# Altium project ActiTouch.PrjPcb
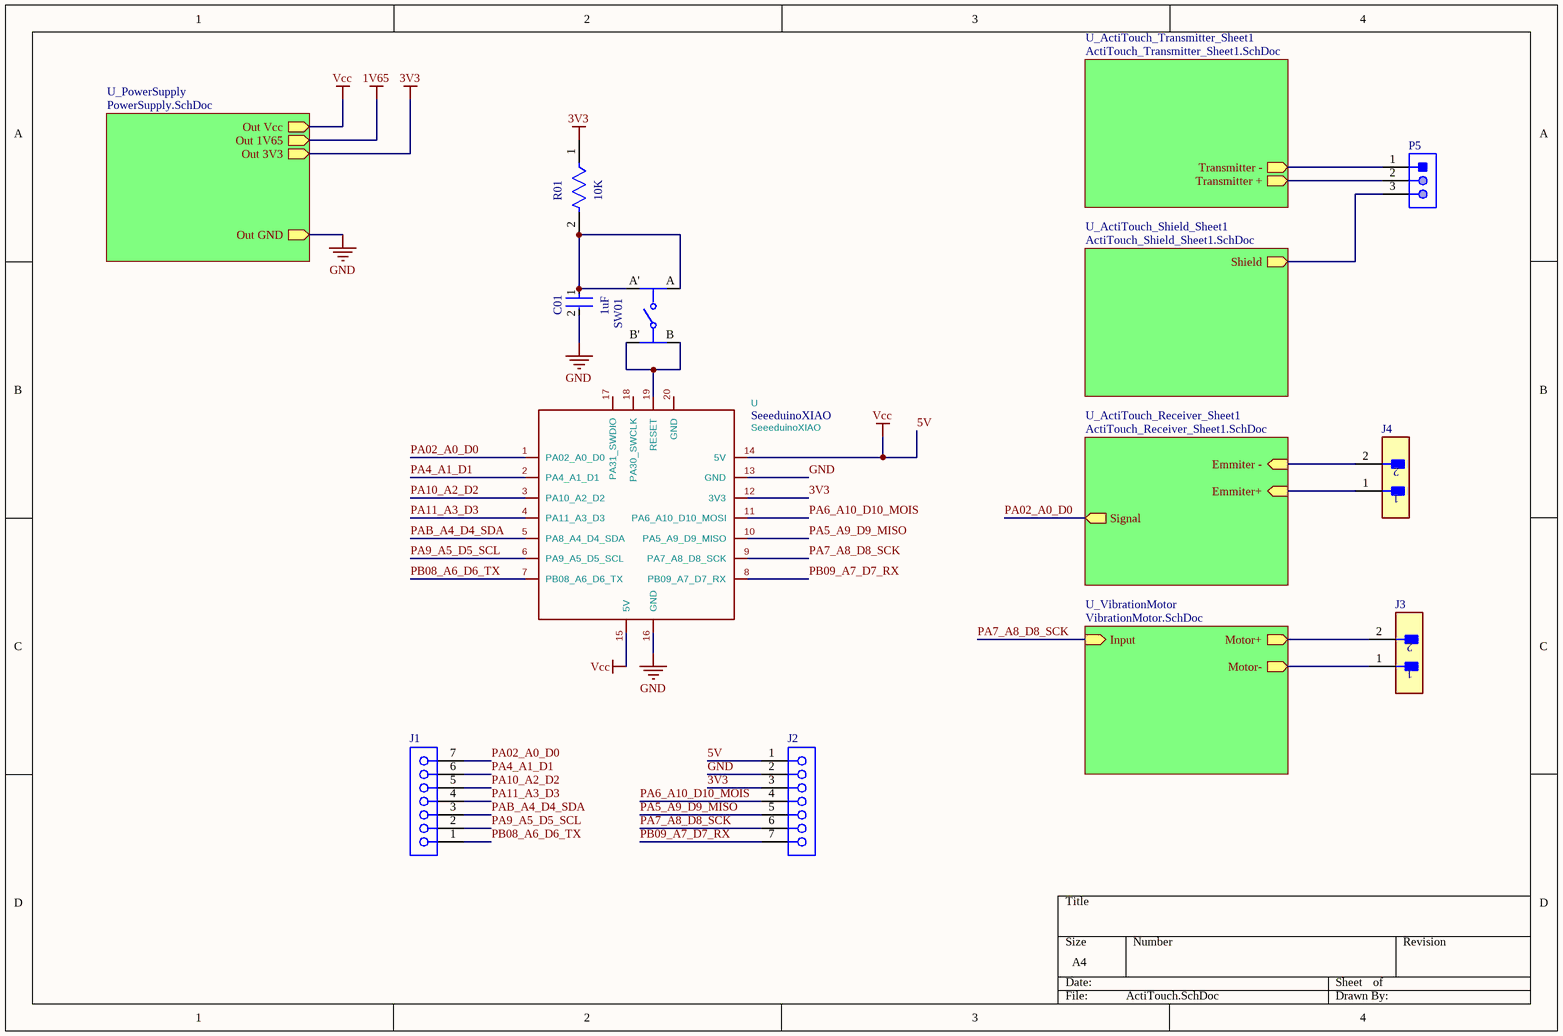
[diagram p0: ActiTouch.SchDoc]
6 sheets, 65 parts. Net scope: hierarchical (ports join the sheet entries above them; power ports are global).
Board files: ActiTouch_PCB1.PcbDoc, ActiTouch_PCB2.PcbDoc
Sheets:
  ActiTouch.SchDoc
    U_ActiTouch_Shield_Sheet1 = ActiTouch_Shield_Sheet1.SchDoc
    U_VibrationMotor = VibrationMotor.SchDoc
    U_ActiTouch_Receiver_Sheet1 = ActiTouch_Receiver_Sheet1.SchDoc
    U_ActiTouch_Transmitter_Sheet1 = ActiTouch_Transmitter_Sheet1.SchDoc
    U_PowerSupply = PowerSupply.SchDoc

## Sheet ActiTouch.SchDoc
size A4; SheetNumber: 1; SheetTotal: 6

### Parts
C01  1uF  [FP-0603-L_1_6_0_15-W_0_81-IPC_A]
J1  SSQ-107-01-G-S  [SMTC-SSQ-107-01-X-S]  (value not drawn)
J2  SSQ-107-01-G-S  [SMTC-SSQ-107-01-X-S]  (value not drawn)
J3  GRPB021VWVN-RC  [FP-GRPB021VWVN-RC-MFG]  (value not drawn)
J4  GRPB021VWVN-RC  [FP-GRPB021VWVN-RC-MFG]  (value not drawn)
P5  GRPB031VWVN-RC  [SLIN-GRPB031VWVN-RC_V]  (value not drawn)
R01  10K  [FP-RNCP0603-MFG]
SW01  EVPAF7B70  [FP-EVPAF7B70-MFG]  (value not drawn)
U  SeeeduinoXIAO  [Seeeduino XIAO-MOUDLE14P-2.54-21X17.8MM]

### Sub-sheets
U_ActiTouch_Receiver_Sheet1 = ActiTouch_Receiver_Sheet1.SchDoc: Emmiter+ (in), Emmiter - (in), Signal (out)
U_ActiTouch_Shield_Sheet1 = ActiTouch_Shield_Sheet1.SchDoc: Shield (out)
U_ActiTouch_Transmitter_Sheet1 = ActiTouch_Transmitter_Sheet1.SchDoc: Transmitter + (out), Transmitter - (out)
U_PowerSupply = PowerSupply.SchDoc: Out Vcc (out), Out 1V65 (out), Out GND (out), Out 3V3 (out)
U_VibrationMotor = VibrationMotor.SchDoc: Input (in), Motor+ (out), Motor- (out)

### Nets
3V3: J2.3 R01.1 U.12(3V3) ; sheet U_PowerSupply/Out 3V3
5V: J2.1 U.14(5V) U.15(5V) ; sheet U_PowerSupply/Out Vcc  [also labelled Vcc]
GND: C01.2 J2.2 U.13(GND) U.16(GND) ; sheet U_PowerSupply/Out GND
PA02_A0_D0: J1.7 U.1(PA02_A0_D0) ; sheet U_ActiTouch_Receiver_Sheet1/Signal
PA4_A1_D1: J1.6 U.2(PA4_A1_D1)
PA5_A9_D9_MISO: J2.5 U.10(PA5_A9_D9_MISO)
PA6_A10_D10_MOIS: J2.4 U.11(PA6_A10_D10_MOSI)
PA7_A8_D8_SCK: J2.6 U.9(PA7_A8_D8_SCK) ; sheet U_VibrationMotor/Input
PA9_A5_D5_SCL: J1.2 U.6(PA9_A5_D5_SCL)
PA10_A2_D2: J1.5 U.3(PA10_A2_D2)
PA11_A3_D3: J1.4 U.4(PA11_A3_D3)
PAB_A4_D4_SDA: J1.3 U.5(PA8_A4_D4_SDA)
PB08_A6_D6_TX: J1.1 U.7(PB08_A6_D6_TX)
PB09_A7_D7_RX: J2.7 U.8(PB09_A7_D7_RX)
NetC01_1: C01.1 R01.2 SW01.A SW01.A'
NetC1_2: P5.2 ; sheet U_ActiTouch_Transmitter_Sheet1/Transmitter +
NetC3_2: P5.1 ; sheet U_ActiTouch_Transmitter_Sheet1/Transmitter -
NetC20_1: J4.1 ; sheet U_ActiTouch_Receiver_Sheet1/Emmiter+
NetC21_1: J4.2 ; sheet U_ActiTouch_Receiver_Sheet1/Emmiter -
NetC41_1: J3.1 ; sheet U_VibrationMotor/Motor-
NetC41_2: J3.2 ; sheet U_VibrationMotor/Motor+
NetC51_1: P5.3 ; sheet U_ActiTouch_Shield_Sheet1/Shield
NetSW01_B: SW01.B SW01.B' U.19(RESET)

Not connected (* = marked no-connect by the designer): U 17(PA31_SWDIO) 18(PA30_SWCLK) 20(GND)

### Library data of the parts
C01 = CMP-2006-04559-3: General Purpose Ceramic Capacitor, 0603, 1uF, 10%, X5R, 15%, 10V; Insulation Resistance: 100GR; Dissipation Factor: 5%; Packaging: Tape and Reel; RoHS Compliant: Yes; Height: 0.9mm; Tolerance: 10%; Length: 1.6mm; Depth: 0.81mm; Case/Package: 0603; Max Operating Temperature: 85°C; Series: -; Dielectric: X5R; Construction: Flat; Capacitance: 1uF; REACH SVHC: No SVHC; Voltage Rating: 10V; Number of Pins: 2; Radiation Hardening: No; Case Code (Imperial): 0603; Min Operating Temperature: -55°C; Termination: SMD/SMT; Contact Plating: Tin; Voltage: 10V; Thickness: 0.035inch; Lead Free: Lead Free; Mount: Surface Mount; Width: 0.81mm; Voltage Rating (DC): 10V; Package Quantity: 4000; Case Code (Metric): 1608
J1 J2 = CMP-1023-00284-1: SQ Post Socket, Through-hole, Vertical, -55 to 125 degC, 2.54 mm Pitch, 7-Pin, Female, RoHS; Manufacturer: Samtec; Pitch: 2.54 mm; PackageDescription: Assembly, Socket Strip .025[0.64] SQ Tail; PartNumber: SSQ-107-01-G-S; PackageReference: SSQ-107-01-X-S; ComponentLink2URL: http://www.samtec.com/documents/webfiles/pdf/SSQ_TH.PDF; ComponentLink1URL: http://www.samtec.com; ComponentLink3Description: Package Specification; PackageVersion: BD, 6/1987; RoHS: True; DatasheetVersion: F-214; Mounting Technology: Through-hole; ComponentLink3URL: http://www.samtec.com/documents/webfiles/cpdf/SSQ-1XX-XX-XXX-X-XX-XXX-XX-X-MKT.pdf; ComponentLink1Description: Manufacturer URL; Temperature Range: -55 to 125 degC; Orientation: Vertical; ComponentLink2Description: Datasheet
J3 J4 = CMP-2000-06371-2: CONN HEADER VERT 2POS 1.27MM; Number of Positions: 2; Connector Type: Male Pin; Pitch: 0.05inch; Contact Plating: Gold; Lead Free: Lead Free; Termination: Solder; Packaging: Bulk; RoHS Compliant: Yes; Contact Type: Male Pin; Mount: Through Hole; Number of Rows: 1; Contact Mating Length: 0.118inch; Package Quantity: 1
P5 = CMP-2000-06372-1: Male Header, Pitch 1.27 mm, 1 x 3 Position, Height 4 mm, Tail Length 2.3 mm, -40 to 105 degC, RoHS, Bulk; Manufacturer: Sullins; Other Names: S9014E-03; Number of Positions: 3; Connector Type: Header,Unshrouded; Pitch: 0.050"(1.27mm); Dynamic Catalog: GRPB; Catalog Drawings: S9014ESeriesTop; Mating Products: S9010E-03-ND / -CONNHEADER.050"3POSR/APCB / S9008E-03-ND / -CONNHEADER.050"3POSPCBGOLD / S9005E-03-ND / -CONNHEADER.050"3POSSMDGOLD; Number of Positions Loaded: All; Contact Finish: Gold; Mounting Type: ThroughHole; Termination: Solder; Packaging: Bulk; Category: Connectors,Interconnects; Package Description: Male Header, Pitch 1.27 mm, 1 x 3 Position, Height 4 mm, Tail Length 2.3 mm; Standard Package: 1; Datasheet URL: http://www.sullinscorp.com/drawings/71_GRPB___1VWVN-RC,_10957-C.pdf; Package Reference: GRPB031VWVN-RC; Family: RectangularConnectors-Headers,MalePins; Number of Rows: 1; Contact Type: MalePin; Manufacturer URL: http://www.sullinscorp.com/; Mounting Technology: ThroughHole; Contact Mating Length: 0.118"(3.00mm); Contact Finish Thickness: Flash; Datasheet Version: Rev. C, 12/2008
R01 = CMP-26527-000144-1: 12.4kΩ ±1% 0.125W 0603 High Power Anti-Sulfur Thin Film Chip Resistor; Temperature Coefficient: 100ppm/°C; Max Power Dissipation: 125mW; Resistance: 12.4kR; Mount: Surface Mount; Number of Terminations: 2; Case Code (Imperial): 0603; Length: 0.059inch; Tolerance: 1%; Width: 0.031inch; Max Operating Temperature: 155°C; Case/Package: 0603; Packaging: Cut Tape; Min Operating Temperature: -55°C; RoHS Compliant: Yes; Height: 0.02inch; Features: Moisture Resistant; Resistor Type: Thin Film; Case Code (Metric): 1608; Series: RNCP
SW01 = CMP-05618-000093-1: SWITCH TACTILE SPST-NO 0.02A 15V; Mechanical Life: 500000Cycles; Illumination Type: Non-Illuminated; Max Current Rating: 20mA; Switch Travel: 0.15mm; Switch Function: Off-Mom; Operating Force: 2.4N; Contact Resistance: 500mR; Actuator Type: Standard; Current Rating: 50mA; Actuator Length: 0.22mm; Throw Configuration: SPST; REACH SVHC: No SVHC; Max Voltage Rating (DC): 15V; Package Quantity: 1; Radiation Hardening: No; Mount: Surface Mount; Size: 2.6mm; Min Operating Temperature: -40°C; Depth: 3.4mm; Series: EVPAF; Color: Black; Electrical Life: 500000Cycles; Orientation: Straight; Packaging: Tape and Reel; Voltage Rating (DC): 15V; Contact Plating: Silver; Case/Package: SMD/SMT; Termination: J-Bend; Height: 0.7mm; Length: 2.6mm; Max Operating Temperature: 85°C
U = SeeeduinoXIAO: Value: SeeeduinoXIAO

## Sheet ActiTouch_Shield_Sheet1.SchDoc
size A4; SheetNumber: 4; SheetTotal: 6
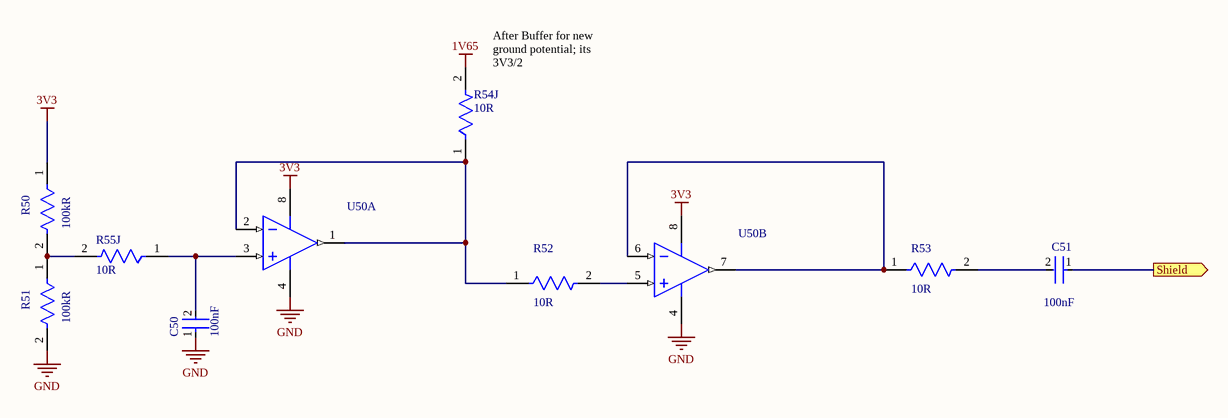
[diagram p1: ActiTouch_Shield_Sheet1.SchDoc]

### Parts
C50  Capacitance: 100nF  [FP-0603-L_1_6_0_1-W_0_8_0-IPC_B]  (hidden comment: EMK107B7104KAHT)
C51  Capacitance: 100nF  [FP-0603-L_1_6_0_1-W_0_8_0-IPC_B]  (hidden comment: EMK107B7104KAHT)
R50  Resistance: 100kR  [FP-RMCF0603-IPC_C]  (hidden comment: RMCF0603FT100K)
R51  Resistance: 100kR  [FP-RMCF0603-IPC_C]  (hidden comment: RMCF0603FT100K)
R52  Resistance: 10R  [FP-RNCP0603-MFG]  (hidden comment: RNCP0603FTD10R0)
R53  Resistance: 10R  [FP-RNCP0603-MFG]  (hidden comment: RNCP0603FTD10R0)
R54J  Resistance: 10R  [FP-RNCP0603-MFG]  (hidden comment: RNCP0603FTD10R0)
R55J  Resistance: 10R  [FP-RNCP0603-MFG]  (hidden comment: RNCP0603FTD10R0)
U50  OPA2836IDR  [D0008A_M]  (value not drawn)  (parts A,B of 2)

### Ports
Shield (out)

### Nets
1V65: R54J.2
3V3: R50.1 U50.8(VS+)
GND: C50.1 R51.2 U50.4(VS-)
NetC50_2: C50.2 R55J.1 U50.3(VIN1+)
NetC51_1: C51.1 ; port Shield
NetC51_2: C51.2 R53.2
NetR50_2: R50.2 R51.1 R55J.2
NetR52_1: R52.1 R54J.1 U50.1(VOUT1) U50.2(VIN1-)
NetR52_2: R52.2 U50.5(VIN2+)
NetR53_1: R53.1 U50.6(VIN2-) U50.7(VOUT2)

### Notes on the sheet
- (near R54J) After Buffer for new ground potential; its 3V3/2

### Library data of the parts
C50 C51 = CMP-14477-003798-2: None; Voltage Rating (DC): 16V; Tolerance: 10%; Package Quantity: 4000; Packaging: Tape and Reel; Lead Free: Lead Free; Voltage Rating: 16V; Halogen Free: Halogen Free; Case/Package: 0603
R50 R51 = CMP-2000-06989-2: 100kΩ ±1% 0.1W 0603 Thick Film Chip Resistor AEC-Q200 compliant; Working Voltage: 75V; Max Power Dissipation: 100mW; Temperature Coefficient: 100ppm/°C; Height: 0.022inch; Construction: Rectangular; Lead Free: Lead Free; Tolerance: 1%; Features: Automotive AEC-Q200; Packaging: Tape and Reel; Number of Terminations: 2; Mount: Surface Mount; Case Code (Imperial): 0603; Case/Package: 0603; Resistor Type: Thick Film; Radiation Hardening: No; Power Rating: 100mW; Max Operating Temperature: 155°C; Length: 1.55mm; Width: 0.031inch; Military Standard: Not; RoHS Compliant: Yes; Min Operating Temperature: -55°C; Series: RMCF; Depth: 0.8mm; Case Code (Metric): 1608; Contact Plating: Tin
R52 R53 R54J R55J = CMP-26527-000751-1: 10Ω ±1% 0.125W 0603 High Power Anti-Sulfur Thin Film Chip Resistor; Temperature Coefficient: 100ppm/°C; Max Power Dissipation: 125mW; Case Code (Imperial): 0603; Case/Package: 0603; Tolerance: 1%; Features: Moisture Resistant; Width: 0.031inch; Series: RNCP; Lead Free: Lead Free; Max Operating Temperature: 155°C; Height: 0.02inch; Length: 0.059inch; Case Code (Metric): 1608; Min Operating Temperature: -55°C; Packaging: Tape and Reel; Resistor Type: Thin Film; RoHS Compliant: Yes; Mount: Surface Mount; Number of Terminations: 2
U50 = CMP-0018-00293-2: Dual, Very Low Power, Rail to Rail Out, Negative Rail In, VFB Operational Amplifier, 2.5 to 5.5 V, -40 to 85 degC, 8-pin SOIC (D8), Green (RoHS & no Sb/Br); Manufacturer: Texas Instruments; Settling Time (0.1%)(Typ)(ns): 30; Iib(Max)(nA): 1000; Vio(Max)(mV): 0.4; Vs(Min)(V): 2.5; Vs(Max)(V): 5.5; Io(Typ)(mA): 50; Sub Family: High Output Current Amplifier (>=50mA), High Speed Amplifier (>=50MHz), Low Noise Amp (<=10nV/rtHz), Low Offset Voltage Amplifier (<=500uV), Low Supply Voltage Amplifier (<=2.7V); Vn at Flatband(Typ)(nV/rtHz): 4.6; Slew Rate(Typ)(V/us): 560; Number of Channels: 2; Iq per channel(Max)(mA): 1; BW @ Acl(MHz): 205; 3rd Harmonic(dBc): 105; 2nd Harmonic(dBc): 85; Mounting Technology: Surface Mount; ComponentLink3URL: http://www.ti.com/litv/pdf/msoi002j; ComponentLink1URL: http://www.ti.com/; DatasheetVersion: SLOS712D; Code_JEDEC: MS-012; PackageDescription: 8-Pin Plastic Small Outline, Body 4.9 x 3.9 mm, Pitch 1.27 mm; ComponentLink3Description: Package Specification; Eco-Plan: Green (RoHS & no Sb/Br); PackageReference: D0008A; PackageVersion: 4040047-3/M, 06/2011; PartNumber: OPA2836IDR; ComponentLink2Description: Datasheet; Acl, min stable gain(V/V): 1; ComponentLink1Description: Manufacturer URL; ComponentLink2URL: http://www.ti.com/general/docs/lit/getliterature.tsp?genericPartNumber=OPA2836&fileType=pdf

## Sheet VibrationMotor.SchDoc
size A4; SheetNumber: 6; SheetTotal: 6
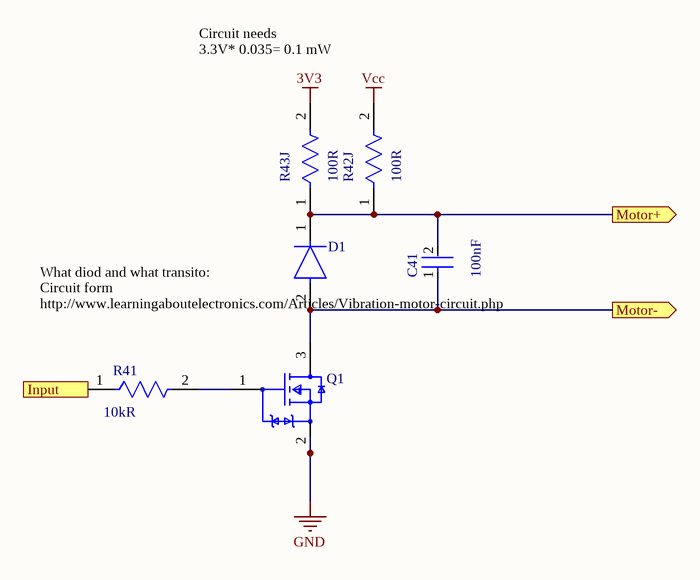
[diagram p2: VibrationMotor.SchDoc]

### Parts
C41  Capacitance: 100nF  [FP-0603-L_1_6_0_1-W_0_8_0-IPC_B]  (hidden comment: EMK107B7104KAHT)
D1  LS4448GS08  [FP-6_560-5006_01-4-MFG]  (value not drawn)
Q1  DMG2302UK-7  [FP-SOT23-MFG]  (value not drawn)
R41  Resistance: 10kR  [FP-RNCP0603-IPC_A]  (hidden comment: RNCP0603FTD10K0)
R42J  Resistance: 100R  [FP-ESR03-MFG]  (hidden comment: ESR03EZPJ101)
R43J  Resistance: 100R  [FP-ESR03-MFG]  (hidden comment: ESR03EZPJ101)

### Ports
Input (in), Motor+ (out), Motor- (out)

### Nets
3V3: R43J.2
GND: Q1.2(S)
Vcc: R42J.2  [project net 5V]
PA7_A8_D8_SCK: R41.1 ; port Input
NetC41_1: C41.1 D1.2(A) Q1.3(D) ; port Motor-
NetC41_2: C41.2 D1.1(C) R42J.1 R43J.1 ; port Motor+
NetQ1_1: Q1.1(G) R41.2

### Notes on the sheet
- Circuit needs
  3.3V* 0.035= 0.1 mW
  With Vibro Motor
  https://www.distrelec.ch/de/vibrationsmotor-seeed-studio-316040004/p/30214484
- What diod and what transito:
  Circuit form http://www.learningaboutelectronics.com/Articles/Vibration-motor-circuit.php

### Library data of the parts
C41 = CMP-14477-003798-2: as C50 on sheet ActiTouch_Shield_Sheet1; Package Quantity: 4000; Packaging: Tape and Reel; Lead Free: Lead Free; Voltage Rating: 16V; Halogen Free: Halogen Free; Case/Package: 0603
D1 = CMP-02540-000047-1: DIODE GEN PURP 100V 300MA SOD80; Manufacturer: Vishay; Max Junction Temp: +175°C; Reverse Voltage: 75V; Peak Reverse Current: 5uA; Automotive Grade: Grade 0; Value: 4pF; Max Surge Forward Current: 2A; Category: Diode; Forward Current: 300mA; ComponentLink2Description: Datasheet; Lead Free: Yes; Automotive: Yes; Device Class L1: Discrete Semiconductors; Temperature: to +175°C; Package: 6.560-5006.01-4; Max Repetitive Reverse Voltage: 100V; RoHS: TRUE; Manufacturer Part Number: LS4448GS08; ComponentLink2URL: http://www.vishay.com/docs/85561/ls4148.pdf; Device Class L3: Rectifier Diodes; Capacitance: 4pF; Octopart: https://octopart.com/ls4448gs08-vishay-55433966; Digikey Description: DIODE GEN PURP 100V 300MA SOD80; Device Class L2: Diodes; Height: 1.6mm; Mouser Description: Diodes - General Purpose, Power, Switching 100V Io/150mA 2.0 Amp IFSM; Temperature Range High: +175°C
Q1 = CMP-12801-000001-1: MOSFET N-CH 20V 2.8A SOT23; Manufacturer: Diodes Inc.; Reverse Recovery Time: 5.3ns; Gate Charge At Vgs: 2.8nC @ 10V; Turn On Delay Time: 0.6ns; Pulse Drain Current: 12A; Max Forward Diode Voltage: 1.2V; Reverse Recovery Charge: 0.5nC; Automotive Grade: Grade 0; Threshold Vgs Min: 0.3V; Number Of N Channels: 1; Standoff Height: 0.013mm; Typ Forward Diode Voltage: 0.7V; Drain To Source Resistance: 61mΩ; Rthja Max: 192°C/W; Max Junction Temp: +150°C; Input Capacitace At Vds: 130pF @ 10V; Threshold Vgs Max: 1V; Turn Off Delay Time: 4.2ns; Depletion Mode: False; Gate To Source Voltage: 12V; Power Dissipation: 0.66W; Device Class L1: Discrete Semiconductors; Footprint Url: https://www.diodes.com/assets/Package-Files/SOT23.pdf; Lead Free: Yes; Manufacturer Part Number: DMG2302UK-7; Temperature Range High: +150°C; Drain To Source Voltage: 20V; Category: Trans; Digikey Description: MOSFET N-CH 20V 2.8A SOT23; RoHS: TRUE; Device Class L2: Transistors; Height: 1.1mm; Automotive: Yes; Package: SOT23; Drain To Source Breakdown Voltage: 20V; Continuous Drain Current: 2.8A; ComponentLink2Description: Datasheet; Device Class L3: MOSFETs; Octopart: https://octopart.com/dmg2302uk-7-diodes+inc.-73850182; Temperature Range Low: -55°C; Temperature: -55°C to +150°C; Number Of Channels: 1; ComponentLink2URL: https://www.diodes.com/assets/Datasheets/DMG2302UK.pdf
R41 = CMP-26527-000099-1: 10kΩ ±1% 0.125W 0603 High Power Anti-Sulfur Thin Film Chip Resistor; Max Power Dissipation: 125mW; Temperature Coefficient: 100ppm/°C; Max Operating Temperature: 155°C; Width: 0.031inch; Height: 0.02inch; Lead Free: Lead Free; Contact Plating: Tin; Tolerance: 1%; Resistor Type: Thin Film; Series: RNCP; RoHS Compliant: Yes; Features: Moisture Resistant; Min Operating Temperature: -55°C; Case Code (Metric): 1608; Case/Package: 0603; Mount: Surface Mount; Packaging: Tape and Reel; Radiation Hardening: No; Length: 0.059inch; Number of Terminations: 2; Case Code (Imperial): 0603
R42J R43J = CMP-08839-000028-1: 100Ω ±5% 0.25W 0603 Anti-Surge Chip Resistor AEC-Q200; Power Rating: 200mW; Temperature Coefficient: 200ppm/°C; Max Power Dissipation: 250mW; Case Code (Imperial): 0603; Number of Terminations: 2; RoHS Compliant: Yes; Series: ESR; Lead Free: Lead Free; Features: Automotive AEC-Q200; Case/Package: 0603; Tolerance: 5%; Min Operating Temperature: -55°C; Size Code: 0603; Case Code (Metric): 1608; Max Operating Temperature: 155°C; Packaging: Tape and Reel

## Sheet ActiTouch_Receiver_Sheet1.SchDoc
size A4; SheetNumber: 5; SheetTotal: 6
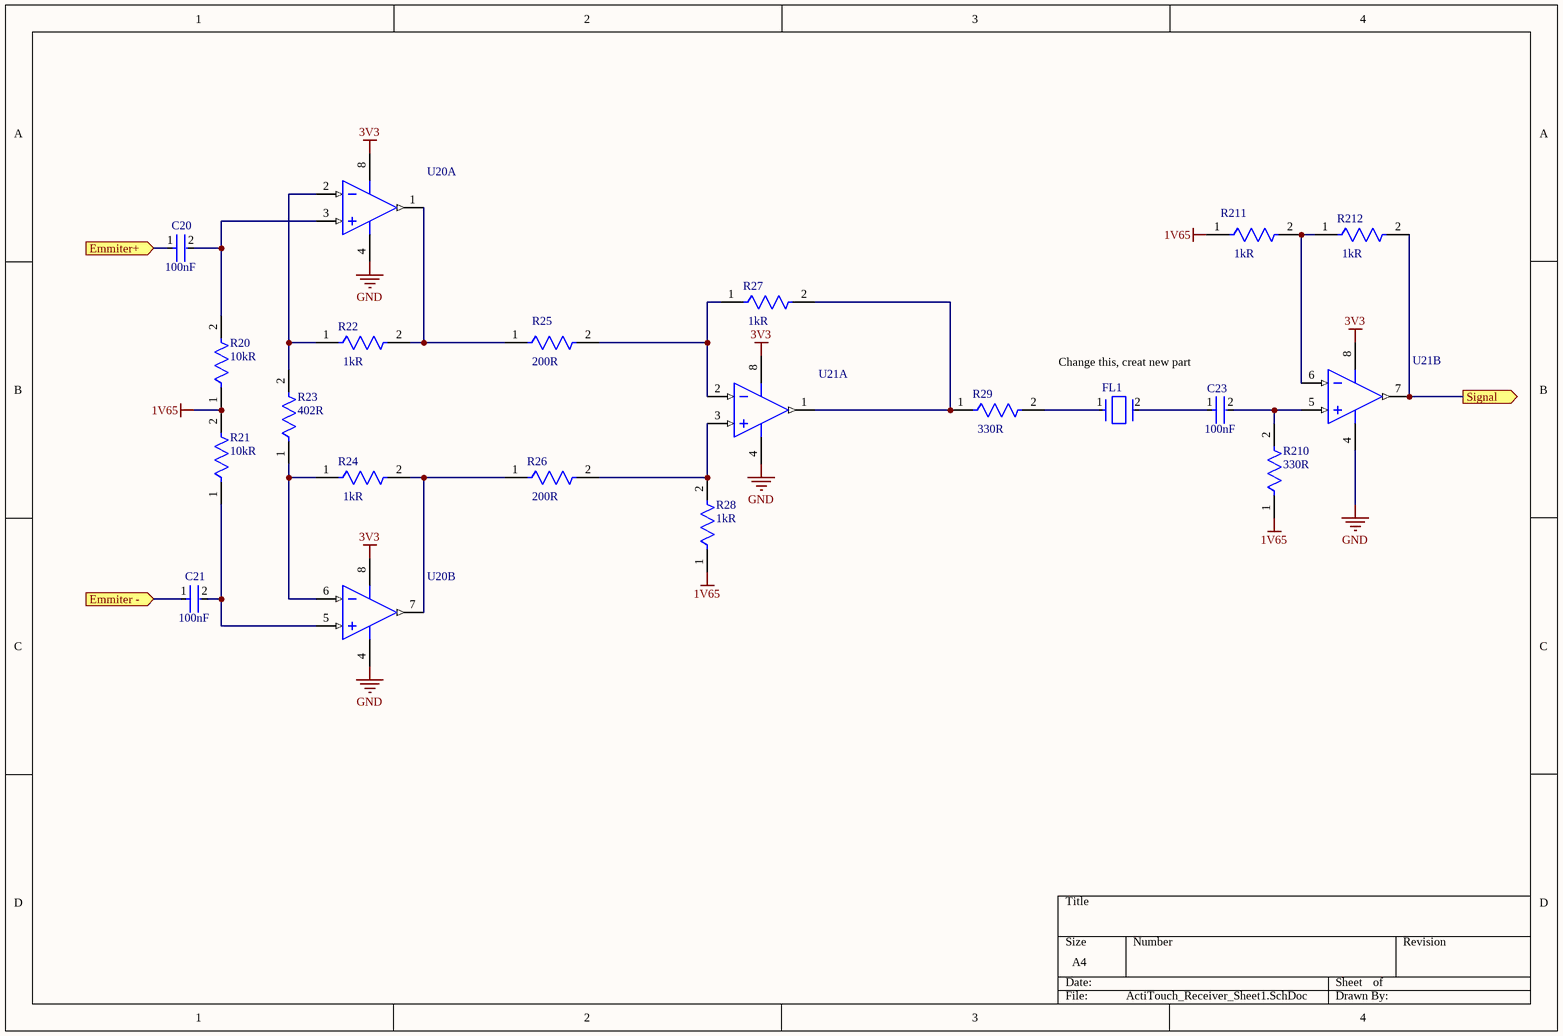
[diagram p3: ActiTouch_Receiver_Sheet1.SchDoc]

### Parts
C20  Capacitance: 100nF  [FP-0603-L_1_6_0_1-W_0_8_0-IPC_B]  (hidden comment: EMK107B7104KAHT)
C21  Capacitance: 100nF  [FP-0603-L_1_6_0_1-W_0_8_0-IPC_B]  (hidden comment: EMK107B7104KAHT)
C23  Capacitance: 100nF  [FP-0603-L_1_6_0_1-W_0_8_0-IPC_B]  (hidden comment: EMK107B7104KAHT)
FL1  CDSCB10M7GA121-R0  [FP-CDSCB10M7GA121-R0-MFG]  (value not drawn)
R20  Resistance: 10kR  [FP-RNCP0603-MFG]  (hidden comment: RNCP0603FTD10R0)
R21  Resistance: 10kR  [FP-RNCP0603-MFG]  (hidden comment: RNCP0603FTD10R0)
R22  Resistance: 1kR  [FP-RNCP0603-MFG]  (hidden comment: RNCP0603FTD10R0)
R23  Resistance: 402R  [FP-RNCP0603-MFG]  (hidden comment: RNCP0603FTD10R0)
R24  Resistance: 1kR  [FP-RNCP0603-MFG]  (hidden comment: RNCP0603FTD10R0)
R25  Resistance: 200R  [FP-RNCP0603-MFG]  (hidden comment: RNCP0603FTD10R0)
R26  Resistance: 200R  [FP-RNCP0603-MFG]  (hidden comment: RNCP0603FTD10R0)
R27  Resistance: 1kR  [FP-RNCP0603-MFG]  (hidden comment: RNCP0603FTD10R0)
R28  Resistance: 1kR  [FP-RNCP0603-MFG]  (hidden comment: RNCP0603FTD10R0)
R29  Resistance: 330R  [FP-RNCP0603-MFG]  (hidden comment: RNCP0603FTD10R0)
R210  Resistance: 330R  [FP-RNCP0603-MFG]  (hidden comment: RNCP0603FTD10R0)
R211  Resistance: 1kR  [FP-RNCP0603-MFG]  (hidden comment: RNCP0603FTD10R0)
R212  Resistance: 1kR  [FP-RNCP0603-MFG]  (hidden comment: RNCP0603FTD10R0)
U20  OPA2836IDR  [D0008A_M]  (value not drawn)  (parts A,B of 2)
U21  OPA2836IDR  [D0008A_M]  (value not drawn)  (parts A,B of 2)

### Ports
Emmiter - (in), Emmiter+ (in), Signal (out)

### Nets
1V65: R20.1 R21.2 R28.1 R210.1 R211.1
3V3: U20.8(VS+) U21.8(VS+)
GND: U20.4(VS-) U21.4(VS-)
PA02_A0_D0: R212.2 U21.7(VOUT2) ; port Signal
NetC20_1: C20.1 ; port Emmiter+
NetC20_2: C20.2 R20.2 U20.3(VIN1+)
NetC21_1: C21.1 ; port Emmiter -
NetC21_2: C21.2 R21.1 U20.5(VIN2+)
NetC23_1: C23.1 FL1.2
NetC23_2: C23.2 R210.2 U21.5(VIN2+)
NetFL1_1: FL1.1 R29.2
NetR22_1: R22.1 R23.2 U20.2(VIN1-)
NetR22_2: R22.2 R25.1 U20.1(VOUT1)
NetR23_1: R23.1 R24.1 U20.6(VIN2-)
NetR24_2: R24.2 R26.1 U20.7(VOUT2)
NetR25_2: R25.2 R27.1 U21.2(VIN1-)
NetR26_2: R26.2 R28.2 U21.3(VIN1+)
NetR27_2: R27.2 R29.1 U21.1(VOUT1)
NetR211_2: R211.2 R212.1 U21.6(VIN2-)

### Notes on the sheet
- Change this, creat new part

### Library data of the parts
C20 C21 C23 = CMP-14477-003798-2: as C50 on sheet ActiTouch_Shield_Sheet1; Package Quantity: 4000; Packaging: Tape and Reel; Lead Free: Lead Free; Voltage Rating: 16V; Halogen Free: Halogen Free; Case/Package: 0603
FL1 = CMP-06047-000004-1: Ceramic Filter 10.7MHz 2-Pin Surface Mount Emboss T/R
R20-R29 R210-R212 = CMP-26527-000751-1: as R52 on sheet ActiTouch_Shield_Sheet1; Case Code (Imperial): 0603; Case/Package: 0603; Tolerance: 1%; Features: Moisture Resistant; Width: 0.031inch; Series: RNCP; Lead Free: Lead Free; Max Operating Temperature: 155°C; Height: 0.02inch; Length: 0.059inch; Case Code (Metric): 1608; Min Operating Temperature: -55°C; Packaging: Tape and Reel; Resistor Type: Thin Film; RoHS Compliant: Yes; Mount: Surface Mount; Number of Terminations: 2
U20 U21 = CMP-0018-00293-2: as U50 on sheet ActiTouch_Shield_Sheet1; Mounting Technology: Surface Mount; ComponentLink3URL: http://www.ti.com/litv/pdf/msoi002j; ComponentLink1URL: http://www.ti.com/; DatasheetVersion: SLOS712D; Code_JEDEC: MS-012; PackageDescription: 8-Pin Plastic Small Outline, Body 4.9 x 3.9 mm, Pitch 1.27 mm; ComponentLink3Description: Package Specification; Eco-Plan: Green (RoHS & no Sb/Br); PackageReference: D0008A; PackageVersion: 4040047-3/M, 06/2011; PartNumber: OPA2836IDR; ComponentLink2Description: Datasheet; Acl, min stable gain(V/V): 1; ComponentLink1Description: Manufacturer URL; ComponentLink2URL: http://www.ti.com/general/docs/lit/getliterature.tsp?genericPartNumber=OPA2836&fileType=pdf

## Sheet ActiTouch_Transmitter_Sheet1.SchDoc
size A4; SheetNumber: 3; SheetTotal: 6
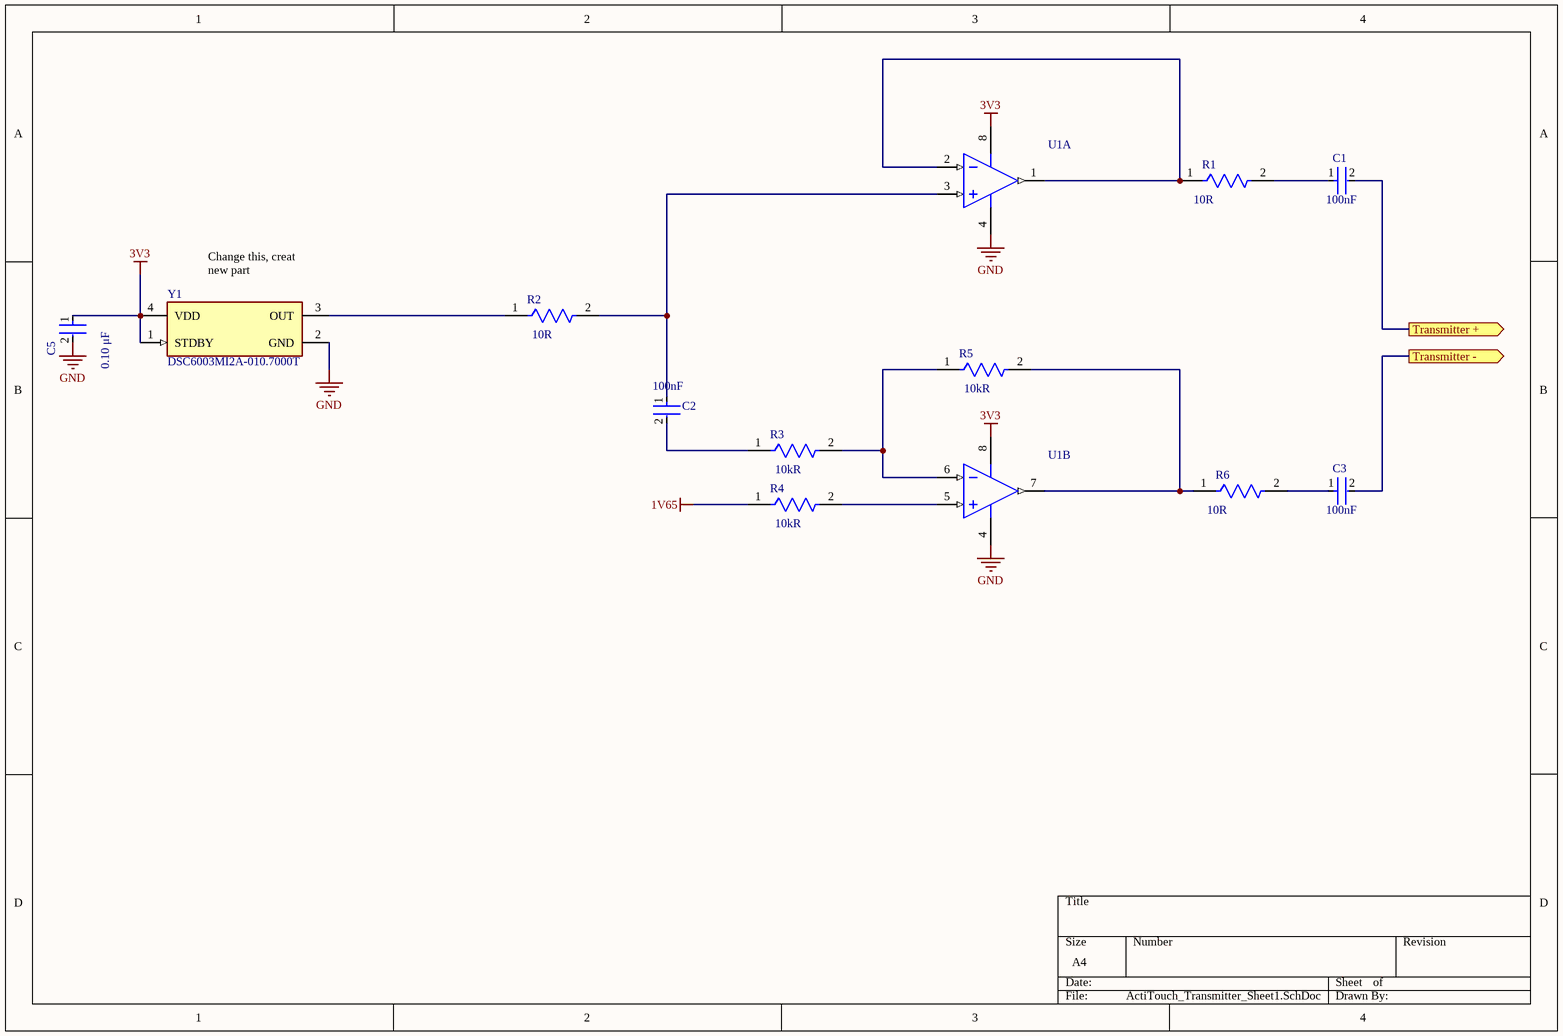
[diagram p4: ActiTouch_Transmitter_Sheet1.SchDoc]

### Parts
C1  Capacitance: 100nF  [FP-0603-L_1_6_0_1-W_0_8_0-IPC_B]  (hidden comment: EMK107B7104KAHT)
C2  Capacitance: 100nF  [FP-0603-L_1_6_0_1-W_0_8_0-IPC_B]  (hidden comment: EMK107B7104KAHT)
C3  Capacitance: 100nF  [FP-0603-L_1_6_0_1-W_0_8_0-IPC_B]  (hidden comment: EMK107B7104KAHT)
C5  value 0.10 μF  [FP-C0603C-CF-MFG]  (hidden comment: C0603C104K5RACTU)
R1  Resistance: 10R  [FP-RNCP0603-MFG]  (hidden comment: RNCP0603FTD10R0)
R2  Resistance: 10R  [FP-RNCP0603-MFG]  (hidden comment: RNCP0603FTD10R0)
R3  Resistance: 10kR  [FP-RNCP0603-MFG]  (hidden comment: RNCP0603FTD10R0)
R4  Resistance: 10kR  [FP-RNCP0603-MFG]  (hidden comment: RNCP0603FTD10R0)
R5  Resistance: 10kR  [FP-RNCP0603-MFG]  (hidden comment: RNCP0603FTD10R0)
R6  Resistance: 10R  [FP-RNCP0603-MFG]  (hidden comment: RNCP0603FTD10R0)
U1  OPA2836IDR  [D0008A_M]  (value not drawn)  (parts A,B of 2)
Y1  DSC6003MI2A-010.7000T  [FP-C04-1202-MFG]

### Ports
Transmitter + (out), Transmitter - (out)

### Nets
1V65: R4.1
3V3: C5.1 U1.8(VS+) Y1.1(STDBY) Y1.4(VDD)
GND: C5.2 U1.4(VS-) Y1.2(GND)
NetC1_1: C1.1 R1.2
NetC1_2: C1.2 ; port Transmitter +
NetC2_1: C2.1 R2.2 U1.3(VIN1+)
NetC2_2: C2.2 R3.1
NetC3_1: C3.1 R6.2
NetC3_2: C3.2 ; port Transmitter -
NetR1_1: R1.1 U1.1(VOUT1) U1.2(VIN1-)
NetR2_1: R2.1 Y1.3(OUT)
NetR3_2: R3.2 R5.1 U1.6(VIN2-)
NetR4_2: R4.2 U1.5(VIN2+)
NetR5_2: R5.2 R6.1 U1.7(VOUT2)

### Notes on the sheet
- (near Y1) Change this, creat new part

### Library data of the parts
C1-C3 = CMP-14477-003798-2: as C50 on sheet ActiTouch_Shield_Sheet1; Package Quantity: 4000; Packaging: Tape and Reel; Lead Free: Lead Free; Voltage Rating: 16V; Halogen Free: Halogen Free; Case/Package: 0603
C5 = CMP-2006-03061-2: CAP CER 0.1UF 50V X7R 0603; Manufacturer: KEMET; Tolerance: 0.1; Temperature Coefficient: 30ppm/°C; Material: Ceramic; Automotive Grade: Grade 1; Temperature: -55°C to +125°C; RoHS: TRUE; Temperature Range High: +125°C; Lead Free: Yes; Octopart: https://octopart.com/c0603c104k5ractu-kemet-139244; Digikey Description: CAP CER 0.1UF 50V X7R 0603; Category: Cap; Package: C0603C-CF; ComponentLink2Description: Datasheet; Temperature Range Low: -55°C; Device Class L1: Passive Components; Voltage Rating: 50 V; Automotive: Yes; Device Class L3: Ceramic Capacitors; ComponentLink2URL: https://api.kemet.com/component-edge/download/datasheet/C0603C100J5GACAUTO.pdf; Capacitance: 0.10 μF; Device Class L2: Capacitors; Manufacturer Part Number: C0603C104K5RACTU; Temperature Characteristic: X7R; Height: 0.87mm
R1-R6 = CMP-26527-000751-1: as R52 on sheet ActiTouch_Shield_Sheet1; Case Code (Imperial): 0603; Case/Package: 0603; Tolerance: 1%; Features: Moisture Resistant; Width: 0.031inch; Series: RNCP; Lead Free: Lead Free; Max Operating Temperature: 155°C; Height: 0.02inch; Length: 0.059inch; Case Code (Metric): 1608; Min Operating Temperature: -55°C; Packaging: Tape and Reel; Resistor Type: Thin Film; RoHS Compliant: Yes; Mount: Surface Mount; Number of Terminations: 2
U1 = CMP-0018-00293-2: as U50 on sheet ActiTouch_Shield_Sheet1; Mounting Technology: Surface Mount; ComponentLink3URL: http://www.ti.com/litv/pdf/msoi002j; ComponentLink1URL: http://www.ti.com/; DatasheetVersion: SLOS712D; Code_JEDEC: MS-012; PackageDescription: 8-Pin Plastic Small Outline, Body 4.9 x 3.9 mm, Pitch 1.27 mm; ComponentLink3Description: Package Specification; Eco-Plan: Green (RoHS & no Sb/Br); PackageReference: D0008A; PackageVersion: 4040047-3/M, 06/2011; PartNumber: OPA2836IDR; ComponentLink2Description: Datasheet; Acl, min stable gain(V/V): 1; ComponentLink1Description: Manufacturer URL; ComponentLink2URL: http://www.ti.com/general/docs/lit/getliterature.tsp?genericPartNumber=OPA2836&fileType=pdf
Y1 = CMP-06255-000006-1: Max Supply Current: 1.3mA; Frequency Stability: 50ppm; Frequency: 24MHz; Case/Package: SMD/SMT; Packaging: Tape and Reel; Min Operating Temperature: -40°C; Ratings: AEC-Q100; Mount: Surface Mount; Max Operating Temperature: 85°C

## Sheet PowerSupply.SchDoc
size A4; SheetNumber: 2; SheetTotal: 6
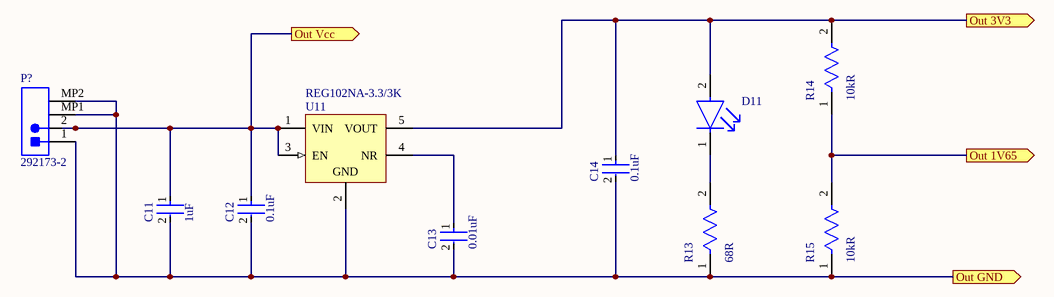
[diagram p5: PowerSupply.SchDoc]

### Parts
C11  Capacitance: 1uF  [FP-0603-L_1_6_0_15-W_0_81-IPC_A]  (hidden comment: 0603ZD105KAT2A)
C12  Capacitance: 0.1uF  [FP-0603-L_1_6_0_15-W_0_81-IPC_A]  (hidden comment: 0603ZD105KAT2A)
C13  Capacitance: 0.01uF  [FP-0603-L_1_6_0_15-W_0_81-IPC_A]  (hidden comment: 0603ZD105KAT2A)
C14  Capacitance: 0.1uF  [FP-0603-L_1_6_0_15-W_0_81-IPC_A]  (hidden comment: 0603ZD105KAT2A)
D11  TLMP1100-GS08  [FP-6_541-5056_01-4-MFG]  (value not drawn)
P?  292173-2  [TECO-292173-2_V]
R13  Resistance: 68R  [FP-CRCW0603-e3-IPC_B]  (hidden comment: CRCW060311K5FKEA)
R14  Resistance: 10kR  [FP-CRCW0603-e3-IPC_B]  (hidden comment: CRCW060311K5FKEA)
R15  Resistance: 10kR  [FP-CRCW0603-e3-IPC_B]  (hidden comment: CRCW060311K5FKEA)
U11  REG102NA-3.3/3K  [DBV0005A_N]

### Ports
Out 1V65 (out), Out 3V3 (out), Out GND (out), Out Vcc (out)

### Nets
1V65: R14.1 R15.2 ; port Out 1V65
3V3: C14.1 D11.2(A) R14.2 U11.5(VOUT) ; port Out 3V3
5V: C11.1 C12.1 P?.2 U11.1(VIN) U11.3(EN) ; port Out Vcc
GND: C11.2 C12.2 C13.2 C14.2 P?.1 P?.MP1 P?.MP2 R13.1 R15.1 U11.2(GND) ; port Out GND
NetC13_1: C13.1 U11.4(NR)
NetD11_1: D11.1(C) R13.2

### Library data of the parts
C11-C14 = CMP-2006-04559-3: as C01 on sheet ActiTouch; Packaging: Tape and Reel; RoHS Compliant: Yes; Height: 0.9mm; Tolerance: 10%; Length: 1.6mm; Depth: 0.81mm; Case/Package: 0603; Max Operating Temperature: 85°C; Series: -; Dielectric: X5R; Construction: Flat; REACH SVHC: No SVHC; Voltage Rating: 10V; Number of Pins: 2; Radiation Hardening: No; Case Code (Imperial): 0603; Min Operating Temperature: -55°C; Termination: SMD/SMT; Contact Plating: Tin; Voltage: 10V; Thickness: 0.035inch; Lead Free: Lead Free; Mount: Surface Mount; Width: 0.81mm; Voltage Rating (DC): 10V; Package Quantity: 4000; Case Code (Metric): 1608
D11 = CMP-02520-000009-1: LED GREEN 0603 SMD; Manufacturer: Vishay; Max Junction Temp: +120°C; Automotive Grade: Grade 3; Reverse Voltage: 6V; Led Orientation: Top View; Forward Voltage: 2.1V; Luminous Intensity: 15mcd; Forward Current: 20mA; Colour: Pure green; Peak Emmision Wavelength: 562nm; Wavelength: 561nm; Viewing Angle: 160°; Power Dissipation: 90mW; Digikey Description: LED GREEN 0603 SMD; Package: 6.541-5056.01-4; Ambient Temperature Range High: +100°C; Height: 0.65mm; Device Class L1: Optoelectronics; Device Class L2: LEDs; Mouser Description: Standard LEDs - SMD Pure Green; Temperature Range High: +120°C; RoHS: TRUE; Ambient Temperature Range Low: -40°C; Temperature: to +120°C; Manufacturer Part Number: TLMP1100-GS08; ComponentLink2URL: http://www.vishay.com/docs/83173/tlmb1100.pdf; Lead Free: Yes; Octopart: https://octopart.com/tlmp1100-gs08-vishay-55433993; Automotive: Yes; Device Class L3: unset; ComponentLink2Description: Datasheet; Category: Diode
P? = CMP-2000-05552-1: Male Header, Pitch 2 mm, 1 x 2 Position, Height 5.8 mm, -40 to 105 degC, RoHS, Tape and Reel; Manufacturer: TE Connectivity; Number of Positions: 2; Other Names: A98624DKR; Pitch: 0.079"(2.00mm); Connector Type: Header,Shrouded; 3D Model: 292173-2.pdf; Dynamic Catalog: CommonTermination,CTSeries; Mating Products: 2-179694-2-ND / -CONNRCPT2POSIDCMT2MMSGL; Number of Positions Loaded: All; Package Reference: 292173-2; Mounting Technology: SurfaceMount; Termination: Solder; Datasheet Version: Rev. C3, 10/2011; Datasheet URL: http://www.te.com/commerce/DocumentDelivery/DDEController?Action=showdoc&DocId=Customer+Drawing%7F292173%7FC3%7Fpdf%7FEnglish%7FENG_CD_292173_C3.pdf%7F292173-2; Contact Mating Length: 0.165"(4.19mm); Series: CommonTermination,CT; Contact Type: MalePin; Packaging: Digi-Reel®; Contact Finish: Tin; Category: Connectors,Interconnects; Family: RectangularConnectors-Headers,MalePins; Color: Black; Package Description: Male Header, Pitch 2 mm, 1 x 2 Position, Height 5.8 mm; Number of Rows: 1; Manufacturer URL: http://www.te.com/; Mounting Type: SurfaceMount,RightAngle; RoHS Information: 292173-2StatementofCompliance; Features: BoardGuide,SolderRetention; Standard Package: 1
R13-R15 = CMP-2000-03864-2: RES Thick Film, 11.5kΩ, 1%, 0.1W, 100ppm/°C, 0603; Working Voltage: 75V; Power Rating: 100mW; Packaging: Tape and Reel; Temperature Coefficient: 100ppm/°C; Weight: 7.1E-05oz; Case Code (Imperial): 0603; Height: 0.45mm; Depth: 0.85mm; Case/Package: 0603; Width: 0.85mm; Radiation Hardening: No; Number of Terminations: 2; Lead Free: Lead Free; Min Operating Temperature: -55°C; Number of Pins: 2; Voltage Rating (DC): 75V; Military Standard: Not; Voltage Rating: 75V; Package Quantity: 10; Composition: Thick Film; Contact Plating: Tin; Max Power Dissipation: 100mW; Length: 1.55mm; Case Code (Metric): 1608; Features: Automotive AEC-Q200; Max Operating Temperature: 155°C; Tolerance: 1%; Termination: SMD/SMT
U11 = CMP-0394-00176-2: Single Output Fast Transient Response LDO, 250 mA, Fixed 3.3 V Output, 1.8 to 12 V Input, 5-pin SOT-23 (DBV), -55 to 125 degC, Green (RoHS & no Sb/Br); Manufacturer: Texas Instruments; Vin(Max)(V): 12; Accuracy(%): 1.5; Vin(Min)(V): 1.8; Vout Adj(Min)(V): 3.3; Iout(Max)(A): 0.25; Vdo(Typ)(mV): 150; SubFamily: Single Channel LDO; Iq(Typ)(mA): 0.4; DatasheetVersion: SBVS024F; PackageDescription: 5-Pin Plastic Small Outline, Body 1.60 Ãƒâ€” 2.90 mm, Pitch 0.95 mm; Code_JEDEC: MO-178; PackageReference: DBV0005A; PackageVersion: 4073253-4/K; Fixed Output Options(V): 3.3; Mounting Technology: Surface Mount; ComponentLink3Description: Package Specification; PartNumber: REG102NA-3.3/3K; ComponentLink2Description: Datasheet; Vout Adj(Max)(V): 3.3; ComponentLink1URL: http://www.ti.com/; ComponentLink3URL: http://www.ti.com/litv/pdf/mpds018i; Eco-Plan: Green (RoHS & no Sb/Br); ComponentLink1Description: Manufacturer URL; ComponentLink2URL: http://www.ti.com/general/docs/lit/getliterature.tsp?genericPartNumber=REG102-33&fileType=pdf

## Nets that join several sheets
1V65: ActiTouch_Shield_Sheet1 (R54J.2), ActiTouch_Receiver_Sheet1 (5 pins), ActiTouch_Transmitter_Sheet1 (R4.1), PowerSupply (R14.1 R15.2)
3V3: ActiTouch (J2.3 R01.1 U.12), ActiTouch_Shield_Sheet1 (R50.1 U50.8), VibrationMotor (R43J.2), ActiTouch_Receiver_Sheet1 (U20.8 U21.8), ActiTouch_Transmitter_Sheet1 (C5.1 U1.8 Y1.1 Y1.4), PowerSupply (C14.1 D11.2 R14.2 U11.5)
5V: ActiTouch (J2.1 U.14 U.15), VibrationMotor (R42J.2), PowerSupply (5 pins)
GND: ActiTouch (C01.2 J2.2 U.13 U.16), ActiTouch_Shield_Sheet1 (C50.1 R51.2 U50.4), VibrationMotor (Q1.2), ActiTouch_Receiver_Sheet1 (U20.4 U21.4), ActiTouch_Transmitter_Sheet1 (C5.2 U1.4 Y1.2), PowerSupply (10 pins)
NetC1_2: ActiTouch (P5.2), ActiTouch_Transmitter_Sheet1 (C1.2)
NetC3_2: ActiTouch (P5.1), ActiTouch_Transmitter_Sheet1 (C3.2)
NetC20_1: ActiTouch (J4.1), ActiTouch_Receiver_Sheet1 (C20.1)
NetC21_1: ActiTouch (J4.2), ActiTouch_Receiver_Sheet1 (C21.1)
NetC41_1: ActiTouch (J3.1), VibrationMotor (C41.1 D1.2 Q1.3)
NetC41_2: ActiTouch (J3.2), VibrationMotor (C41.2 D1.1 R42J.1 R43J.1)
NetC51_1: ActiTouch (P5.3), ActiTouch_Shield_Sheet1 (C51.1)
PA02_A0_D0: ActiTouch (J1.7 U.1), ActiTouch_Receiver_Sheet1 (R212.2 U21.7)
PA7_A8_D8_SCK: ActiTouch (J2.6 U.9), VibrationMotor (R41.1)